# EAGLE schematic stepperdriver (EAGLE 6.4)
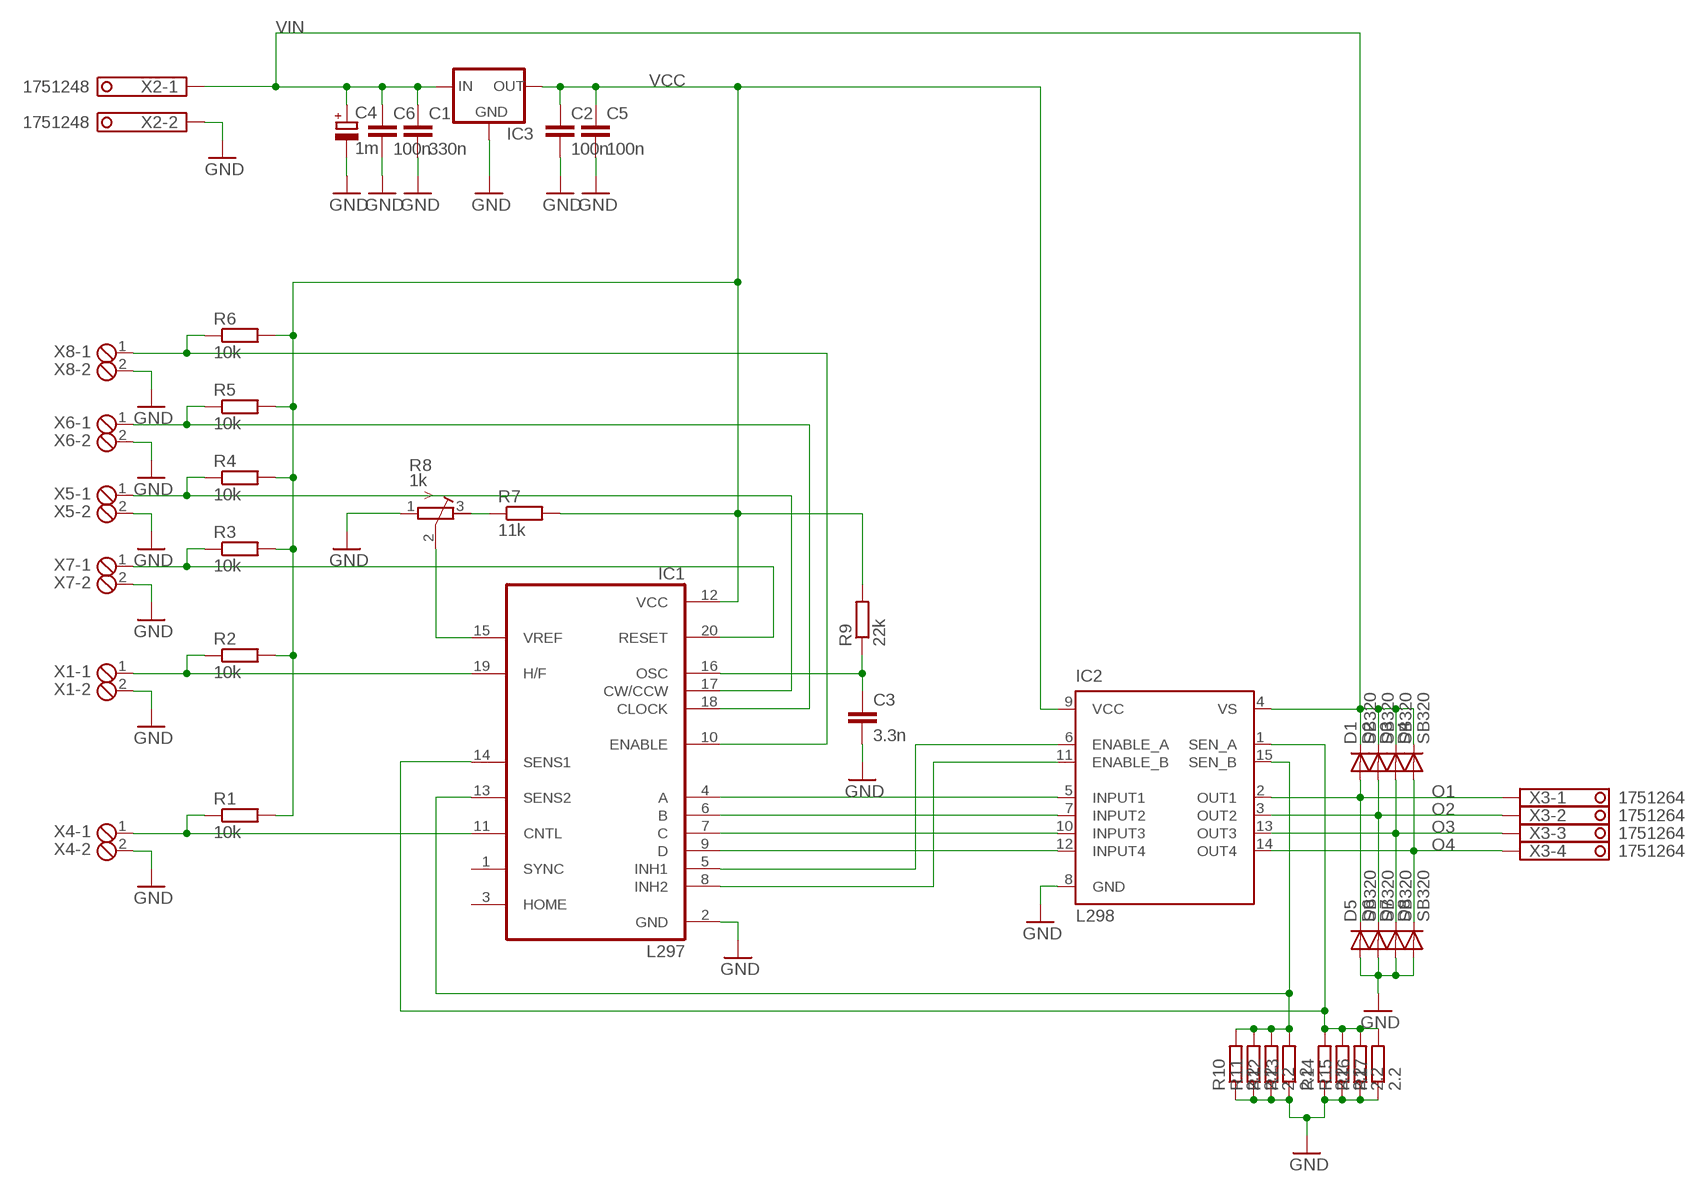
[diagram p0: schematic, sheet 1]

## Parts
C1  330n  C-EU050-035X075  [C050-035X075]
C2  100n  C-EU050-035X075  [C050-035X075]
C3  3.3n  C-EU050-035X075  [C050-035X075]
C4  1m  CPOL-EUE5-13  [E5-13]
C5  100n  C-EU050-035X075  [C050-035X075]
C6  100n  C-EU050-035X075  [C050-035X075]
D1  SB320  [DO201-15]
D2  SB320  [DO201-15]
D3  SB320  [DO201-15]
D4  SB320  [DO201-15]
D5  SB320  [DO201-15]
D6  SB320  [DO201-15]
D7  SB320  [DO201-15]
D8  SB320  [DO201-15]
IC1  L297  [DIL20]
IC2  L298  [MULTIWATT-15]
IC3  78XXS  [78XXS]
R1  10k  R-EU_0207/10  [0207/10]
R2  10k  R-EU_0207/10  [0207/10]
R3  10k  R-EU_0207/10  [0207/10]
R4  10k  R-EU_0207/10  [0207/10]
R5  10k  R-EU_0207/10  [0207/10]
R6  10k  R-EU_0207/10  [0207/10]
R7  11k  R-EU_0207/10  [0207/10]
R8  1k  R-TRIMM64W  [RTRIM64W]
R9  22k  R-EU_0207/10  [0207/10]
R10  2.2  R-EU_0411/15  [0411/15]
R11  2.2  R-EU_0411/15  [0411/15]
R12  2.2  R-EU_0411/15  [0411/15]
R13  2.2  R-EU_0411/15  [0411/15]
R14  2.2  R-EU_0411/15  [0411/15]
R15  2.2  R-EU_0411/15  [0411/15]
R16  2.2  R-EU_0411/15  [0411/15]
R17  2.2  R-EU_0411/15  [0411/15]
X1  MPT2  [2POL254]
X2  1751248  [1751248]
X3  1751264  [1751264]
X4  MPT2  [2POL254]
X5  MPT2  [2POL254]
X6  MPT2  [2POL254]
X7  MPT2  [2POL254]
X8  MPT2  [2POL254]

## Nets
GND [Supply]: C1.2 C2.2 C3.2 C4.- C5.2 C6.2 D5.A D6.A D7.A D8.A IC1.2(GND) IC2.8(GND) IC3.GND R8.1(E) R10.1 R11.1 R12.1 R13.1 R14.1 R15.1 R16.1 R17.1 X1.2 X2.2 X4.2 X5.2 X6.2 X7.2 X8.2
N$1: IC1.9(D) IC2.12(INPUT4)
N$2: IC1.7(C) IC2.10(INPUT3)
N$3: IC1.5(INH1) IC2.6(ENABLE_A)
N$4: IC1.8(INH2) IC2.11(ENABLE_B)
N$5: IC1.6(B) IC2.7(INPUT2)
N$7: IC1.4(A) IC2.5(INPUT1)
N$9 [Motor]: IC1.13(SENS2) IC2.15(SEN_B) R10.2 R11.2 R12.2 R13.2
N$11 [Motor]: IC1.14(SENS1) IC2.1(SEN_A) R14.2 R15.2 R16.2 R17.2
N$12: C3.1 IC1.16(OSC) R9.1
N$13: IC1.19(H/F) R2.1 X1.1
N$14: IC1.10(ENABLE) R6.1 X8.1
N$16: IC1.11(CNTL) R1.1 X4.1
N$17: IC1.17(CW/CCW) R4.1 X5.1
N$18: IC1.18(CLOCK) R5.1 X6.1
N$19: IC1.20(RESET) R3.1 X7.1
N$23: R7.1 R8.3(A)
N$24: IC1.15(VREF) R8.2(S)
O1 [Motor]: D1.A D5.C IC2.2(OUT1) X3.1
O2 [Motor]: D2.A D6.C IC2.3(OUT2) X3.2
O3 [Motor]: D3.A D7.C IC2.13(OUT3) X3.3
O4 [Motor]: D4.A D8.C IC2.14(OUT4) X3.4
VCC: C2.1 C5.1 IC1.12(VCC) IC2.9(VCC) IC3.OUT R1.2 R2.2 R3.2 R4.2 R5.2 R6.2 R7.2 R9.2
VIN [Supply]: C1.1 C4.+ C6.1 D1.C D2.C D3.C D4.C IC2.4(VS) IC3.IN X2.1
Unconnected: IC1.1(SYNC) IC1.3(HOME)

## Library data of the parts
C1-C3 C5 C6 = resistor:C-EU: CAPACITOR, European symbol
C4 = resistor:CPOL-EU: POLARIZED CAPACITOR, European symbol
D1-D8 = diode:SB320: DIODE barrier rectifier, 3 A (Fairchild)
IC1 = st-microelectronics:L297: STEPPER MOTOR CONTROLLER; MPN: L297/1; OC_FARNELL: 1094209; OC_NEWARK: 56P8258
IC2 = st-microelectronics:L298: DUAL FULL-BRIDGE DRIVER; MPN: L298N; OC_FARNELL: 1589425; OC_NEWARK: 32M1527
IC3 = v-reg:78XXS: VOLTAGE REGULATOR
R1-R7 R9-R17 = resistor:R-EU_: RESISTOR, European symbol
R8 = resistor:R-TRIMM: Trimm resistor
X1 X4-X8 = con-phoenix-254:MPT2: PHOENIX CONNECTOR; OC_FARNELL: unknown; OC_NEWARK: unknown
X2 = con-phoenix-350:1751248: MKDS 1/ 2-3,5 Printklemme Nennstrom: 10 A Bemessungsspannung: 160 V Raster: 3,5 mm Polzahl: 2 Montageart: Löten Anschlussart: Schraubanschluss Anschlussrichtung vom Leiter zur Platine: 0° Source: http://eshop.phoenixcontact.com .. 1751248.pdf; OC_FARNELL: unknown; OC_NEWARK: unknown
X3 = con-phoenix-350:1751264: MKDS 1/ 4-3,5 Printklemme Nennstrom: 10 A Bemessungsspannung: 160 V Raster: 3,5 mm Polzahl: 4 Montageart: Löten Anschlussart: Schraubanschluss Anschlussrichtung vom Leiter zur Platine: 0° Source: http://eshop.phoenixcontact.com .. 1751264.pdf; MPN: 1751264; OC_FARNELL: unknown; OC_NEWARK: 10R0934

## Net classes
0 default: width 0.203 mm
1 Supply: width 1.016 mm
2 Motor: width 1.016 mm